# EAGLE design DotSolar (EAGLE 7.7.0)
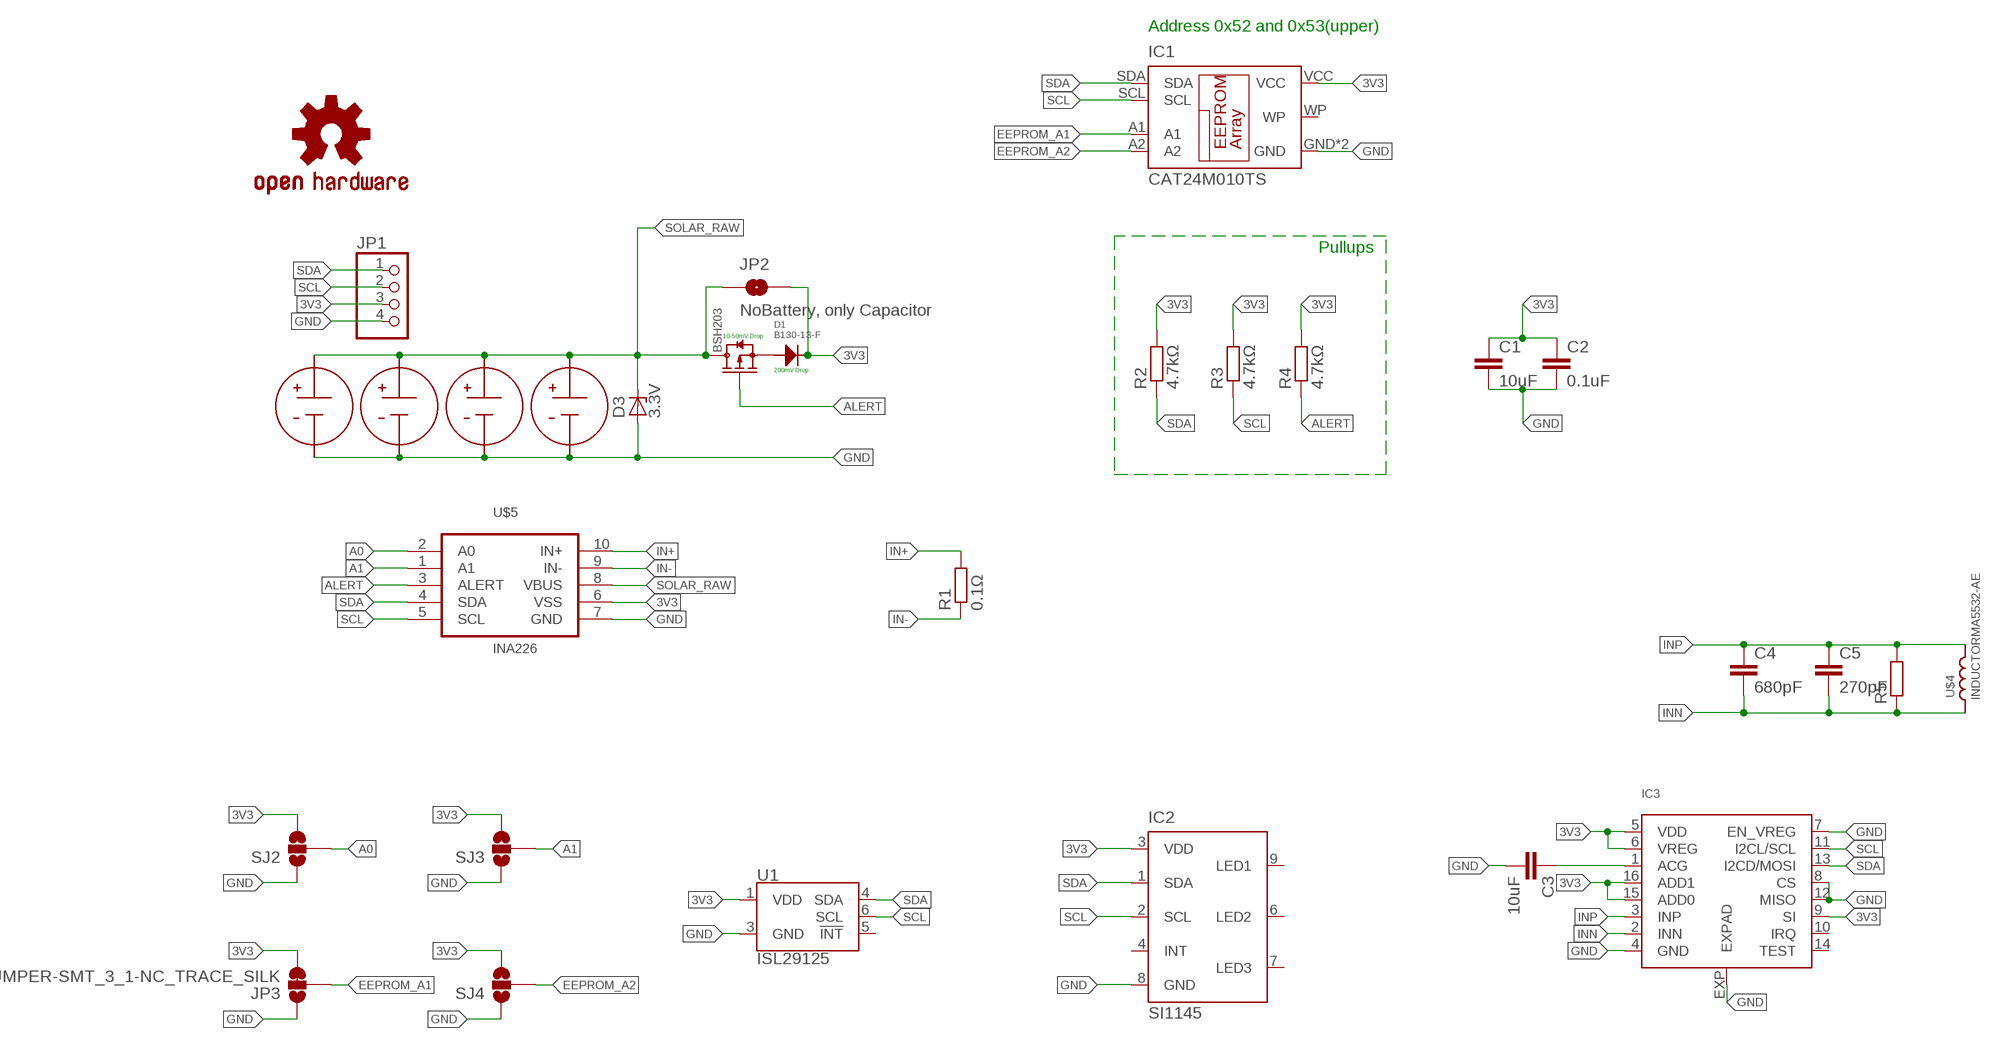
[diagram p0: schematic, sheet 1]

## Parts
C1  10uF  C-EUC0603  [C0603]
C2  0.1uF  C-EUC0603  [C0603]
C3  10uF  C-EUC0603  [C0603]
C4  680pF  C-EUC0603  [C0603]
C5  270pF  C-EUC0603  [C0603]
D1  B130-13-F  DIODE_B130-13-F  [B130-13-F]
D3  3.3V  ZENER-DIODESMB  [SMB]
IC1  CAT24M010TS  [TSSOP8]
IC2  SI1145  [QFN-10]
IC3  AS3935  [16LDMLPQ]
JP1  PINHD-1X4  [1X04]
JP2  NoBattery, only Capacitor  JUMPER-SMT_2_NO_SILK  [SMT-JUMPER_2_NO_SILK]
JP3  JUMPER-SMT_3_1-NC_TRACE_SILK  [SMT-JUMPER_3_1-NC_TRACE_SILK]
LOGO1  OSHW-LOGOS  [OSHW-LOGO-S]
Q1  BSH203  [SOT-23]
R1  0.1Ω  R-EU_R0603  [R0603]
R2  4.7kΩ  R-EU_R0603  [R0603]
R3  4.7kΩ  R-EU_R0603  [R0603]
R4  4.7kΩ  R-EU_R0603  [R0603]
R5  R-EU_R0603  [R0603]
SJ2  SOLDERJUMPER_2WAYPASTE2&3  [SJ_3_PASTE2&3]
SJ3  SOLDERJUMPER_2WAYPASTE2&3  [SJ_3_PASTE2&3]
SJ4  SOLDERJUMPER_2WAYPASTE2&3  [SJ_3_PASTE2&3]
U1  ISL29125  [ODFN-6]
U$1  KXOB22-01X8F_EXTENDED_PADS  [KXOB22-01X8F_EXTENDED_PADS]
U$2  KXOB22-01X8F_EXTENDED_PADS  [KXOB22-01X8F_EXTENDED_PADS]
U$3  KXOB22-01X8F_EXTENDED_PADS  [KXOB22-01X8F_EXTENDED_PADS]
U$4  INDUCTORMA5532-AE  [MA5532-AE]
U$5  INA226  [VSSOP-10]
U$6  KXOB22-01X8F_EXTENDED_PADS  [KXOB22-01X8F_EXTENDED_PADS]

## Nets
3V3: C1.1 C2.1 D1.CATHODE IC1.VCC IC2.3(VDD) IC3.5(VDD) IC3.6(VREG) IC3.9(SI) IC3.15(ADD0) IC3.16(ADD1) JP1.3 JP2.2 JP3.3 R2.2 R3.2 R4.2 SJ2.3 SJ3.3 SJ4.3 U1.1(VDD) U$5.6(VSS)
A0: SJ2.2 U$5.2(A0)
A1: SJ3.2 U$5.1(A1)
ALERT: Q1.1(G) R4.1 U$5.3(ALERT)
EEPROM_A1: IC1.A1 JP3.2
EEPROM_A2: IC1.A2 SJ4.2
GND: C1.2 C2.2 C3.2 D3.A IC1.GND IC1.NC(GND) IC2.8(GND) IC3.4(GND) IC3.7(EN_VREG) IC3.8(CS) IC3.12(MISO) IC3.EXP(EXPAD) JP1.4 JP3.1 SJ2.1 SJ3.1 SJ4.1 U1.3(GND) U$1.P$1 U$2.P$1 U$3.P$1 U$5.7(GND) U$6.P$1
IN+: R1.2 U$5.10(IN+)
IN-: R1.1 U$5.9(IN-)
INN: C4.2 C5.2 IC3.2(INN) R5.1 U$4.2
INP: C4.1 C5.1 IC3.3(INP) R5.2 U$4.1
N$1: D1.ANODE Q1.2(S)
N$3: C3.1 IC3.1(ACG)
SCL: IC1.SCL IC2.2(SCL) IC3.11(I2CL/SCL) JP1.2 R3.1 U1.6(SCL) U$5.5(SCL)
SDA: IC1.SDA IC2.1(SDA) IC3.13(I2CD/MOSI) JP1.1 R2.1 U1.4(SDA) U$5.4(SDA)
SOLAR_RAW: D3.C JP2.1 Q1.3(D) U$1.P$2 U$2.P$2 U$3.P$2 U$5.8(VBUS) U$6.P$2
Unconnected: IC1.WP IC2.4(INT) IC2.6(LED2) IC2.7(LED3) IC2.9(LED1) IC3.10(IRQ) IC3.14(TEST) U1.5(!INT)

## Notes on the sheet
- Address 0x52 and 0x53(upper)
- Pullups
- 10-50mV Drop
- 200mV Drop

## Library data of the parts
C1-C5 = rcl:C-EU: CAPACITOR, European symbol
D1 = PP_Passives:DIODE: Diode - Single
D3 = diode:ZENER-DIODE: Z-Diode
IC1 = CAT24M01YI:CAT24M01: Serial EEPROM 1Mb, I2C; MF: On Semiconductor; MPN: 24C00T-E/ST
IC2 = silabs:SI114*: PROXIMITY/UV/AMBIENT LIGHT SENSOR IC WITH I2C INTERFACE Source: http://www.silabs.com/Support%20Documents/TechnicalDocs/Si1145-46-47.pdf
IC3 = AS3935:AS3935
JP1 = pinhead:PINHD-1X4: PIN HEADER
JP2 = SparkFun-Jumpers:JUMPER-SMT_2_NO: Normally open jumper This jumper has two pads in close proximity to each other. Apply solder to close the connection. Round pads are easier to solder for beginners, but are a lot larger. SparkFun Product that uses the round pads: SparkFun EL Sequencer <https://www.sparkfun.com/products/12781>
JP3 = SparkFun-Jumpers:JUMPER-SMT_3_1-NC_TRACE: Normally closed trace jumper (1 of 2 connections) This jumper has a trace between two pads so it's normally closed (NC). The other connection is normally open (NO). Use a razor knife to open the connection. For best results follow the IPC guidelines for cutting traces: Cutout at least 0.063 mm (0.005 in). Remove all loose material to clean up the cut area. Seal the cut with an approved epoxy. Reapply solder to reclose the connection, or to close the NO connection.
LOGO1 = Particle-Devices:OSHW-LOGO: Open Source Hardware Logo This logo indicates the piece of hardware it is found on incorporates a OSHW license and/or adheres to the definition of open source hardware found here: http://freedomdefined.org/OSHW
Q1 = BSH203:BSH203
R1-R5 = rcl:R-EU_: RESISTOR, European symbol
SJ2-SJ4 = SparkFun:SOLDERJUMPER_2WAY: Solder Jumper 2 way solder jumper
U1 = SparkFun-Sensors:ISL29125: Intersil ISL29125 RGB Color Light Sensor The ISL29125 is a low power, high sensitivity, RED, GREEN and BLUE color light sensor (RGB) with an I2C (SMBus compatible) interface. Its state-of-the-art photodiode array provides an accurate RGB spectral response and excellent light source to light source variation (LS2LS). Datasheet <https://cdn.sparkfun.com/datasheets/Sensors/LightImaging/isl29125.pdf> SparkFun Products SparkFun RGB Light Sensor - ISL29125 <https://www.sparkfun.com/products/12829> (SEN-12829); PROD_ID: IC-12055
U$1-U$3 U$6 = IXYS_Solar_cells:KXOB22-01X8F_EXTENDED_PADS
U$4 = arducorder-mini:INDUCTOR
U$5 = redan:INA226: TI - INA226

## Board
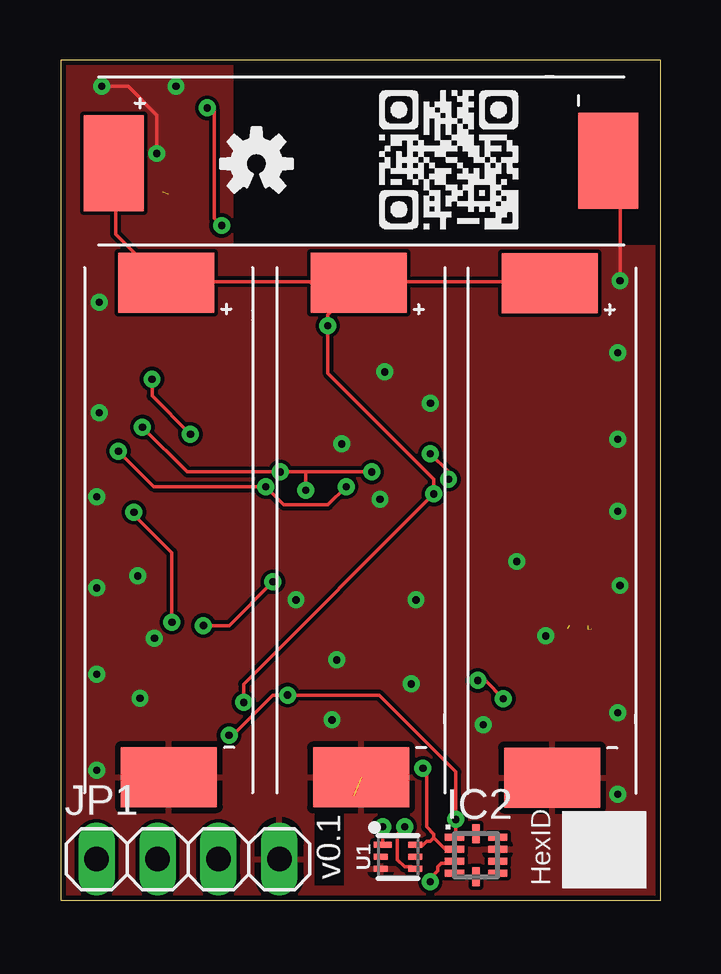
[diagram p1: board, top side]
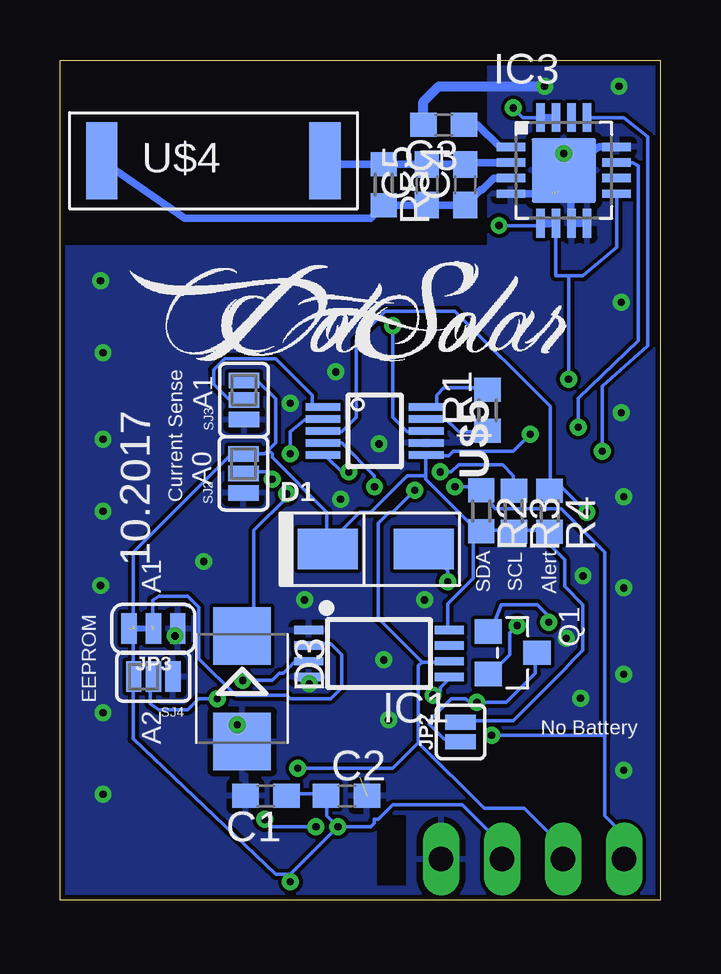
[diagram p2: board, bottom side, seen from below]

Size 25 x 35 mm. Coordinates in mm from the lower left corner, seen from the top.
Outline: 0,0 25,0 25,35 0,35 0,0
Copper layers (1*16): Top 0.035mm / dielectric 1.5mm / Bottom 0.035mm
Design rules "Mihai_default": minimum track width 6mil, minimum drill 0.3mm, track to track 6mil, track to pad 6mil, pad to pad 6mil, via to via 6mil, smd to smd 6mil, copper to edge 8mil, drill to drill 8mil, minimum pad ring 10mil, minimum via ring 8mil, stop-mask expansion 4mil, vias tented up to drill 0mil, thermal gap 10mil
tRestrict: area 10.6,0.6 to 11.8,3.5; area 7.2,27.3 to 24.8,35
bRestrict: area 10.6,0.6 to 11.8,3.5; area 7.2,27.3 to 24.8,35

### Footprints (pad centres in the part's own frame; a part is rotated, then mirrored left to right if it is on the bottom)
C0603 = smd 1.1 x 1: 1 -0.85,0; 2 0.85,0
B130-13-F = smd 2.5 x 1.7: ANODE 2,0; CATHODE -2,0
SMB = smd 2.4 x 2.4: A 2.2,0; C -2.2,0
TSSOP8 = smd 1.2 x 0.35: A1 -2.925,1.595; A2 -2.925,0.945; GND -2.925,0.295; NC -2.925,2.245; SCL 2.925,0.945; SDA 2.925,0.295; VCC 2.925,2.245; WP 2.925,1.595
QFN-10 = smd 0.8 x 0.3: 1 -0.9,0.75; 2 -0.9,0.25; 3 -0.9,-0.25; 4 -0.9,-0.75; 6 0.9,-0.75; 7 0.9,-0.25; 8 0.9,0.25; 9 0.9,0.75 | smd 0.3 x 0.8: 5 0,-0.9; 10 0,0.9
16LDMLPQ = smd 1.2 x 0.35: 1 -2.2,0.975; 2 -2.2,0.325; 3 -2.2,-0.325; 4 -2.2,-0.975; 9 2.2,-0.975; 10 2.2,-0.325; 11 2.2,0.325; 12 2.2,0.975 | smd 0.35 x 1.2: 5 -0.975,-2.2; 6 -0.325,-2.2; 7 0.325,-2.2; 8 0.975,-2.2; 13 0.975,2.2; 14 0.325,2.2; 15 -0.325,2.2; 16 -0.975,2.2 | smd 2.7 x 2.7: EXP 0,0
1X04 = drill 1.016 long: 1 -3.81,0; 2 -1.27,0; 3 1.27,0; 4 3.81,0
SMT-JUMPER_2_NO_SILK = smd 0.635 x 1.27: 1 -0.406,0; 2 0.406,0
SMT-JUMPER_3_1-NC_TRACE_SILK = smd 0.635 x 1.27: 1 -1.016,0; 2 0,0; 3 1.016,0
SOT-23 = smd 1.016 x 1.143: 1 -0.889,-1.016; 2 0.889,-1.016; 3 0,1.016
R0603 = smd 1 x 1.1: 1 -0.85,0; 2 0.85,0
SJ_3_PASTE2&3 = smd 0.635 x 1.27: 1 -0.813,0; 2 0,0; 3 0.813,0
ODFN-6 = smd 0.75 x 0.25: 1 -0.645,0.5 | smd 0.6 x 0.25: 2 -0.72,0; 3 -0.72,-0.5; 4 0.72,-0.5; 5 0.72,0; 6 0.72,0.5
KXOB22-01X8F_EXTENDED_PADS = smd 4 x 2.5: P$1 -0.3,-10; P$2 -0.4,10.6
MA5532-AE = smd 1.3 x 3.2: 1 -4.65,0; 2 4.65,0
VSSOP-10 = smd 0.3 x 1.45: 1 -1,-2.15; 2 -0.5,-2.15; 3 0,-2.15; 4 0.5,-2.15; 5 1,-2.15; 6 1,2.15; 7 0.5,2.15; 8 0,2.15; 9 -0.5,2.15; 10 -1,2.15

### Placement (x,y rotation side)
C1  16.42,4.33 180 bottom
C2  13.06,4.33 0 bottom
C3  9.01,32.3 180 bottom
C4  8.11,29.8 90 bottom
C5  9.71,29.8 90 bottom
D1  11.84,14.62 0 bottom
D3  17.41,8.8 270 bottom
IC1  11.71,9 0 bottom
IC2  17.31,1.86 0 top
IC3  4.01,30.4 0 bottom
JP1  5.31,1.7 0 top
JP2  8.31,7 90 bottom
JP3  21.11,11.3 180 bottom
LOGO1  8.16,30.68 0 top
Q1  6.14,10.3 270 bottom
R1  7.19,20.4 90 bottom
R2  7.45,16.21 270 bottom
R3  6.09,16.19 270 bottom
R4  4.6,16.2 270 bottom
R5  11.51,29.8 270 bottom
SJ2  17.36,17.77 90 bottom
SJ3  17.33,20.83 90 bottom
SJ4  21.11,9.3 180 bottom
U1  14.06,1.79 0 top
U$1  20.78,15.1 0 top
U$2  12.82,15.11 0 top
U$3  12.81,31.1 90 top
U$4  18.61,30.8 0 bottom
U$5  11.89,19.54 270 bottom
U$6  4.81,15.12 0 top

### Tracks (layer width: path | path; a pad name or v marks a point on that pad's centre or on a via)
3V3  (via drill 0.3)  (2 unrouted)
  Top 0.152: v13.42,3.05 U1.1 | v15.4,0.77 15.4,0.92 15.71,1.22 15.71,1.38 15.86,1.53 16.32,1.53 IC2.3 | v3.81,21.7 3.81,21 v5.41,19.4 | v6.11,33 6.31,33 6.41,32.9 6.41,28.4 v6.71,28.1
  Bottom 0.152: 7.48,15.24 7.78,14.94 7.78,13.41 8.85,12.35 8.85,11.28 IC1.VCC | JP2.2 8.24,7.47 6.11,7.47 3.97,9.6 3.61,10 3.21,10.4 3.21,12.3 3.97,13.07 3.97,14.18 4.58,14.79 4.58,15.24 R4.2 4.73,15.4 5.95,15.4 R3.2 6.11,15.4 7.32,15.4 R2.2 7.48,15.24 | 9.76,17.68 9.76,17.53 7.48,15.24 | 9.76,17.68 9.76,18.44 U$5.6 9.7,18.5 8.81,18.5 8.61,18.7 6.11,18.7 v5.41,19.4 | v13.42,3.05 13.88,3.51 13.88,4.27 C2.1 14.03,4.42 15.55,4.42 C1.1 | v13.42,3.05 15.4,1.07 | 21.96,11.28 21.96,9.45 SJ4.3 21.8,9.3 21.8,8.89 21.95,8.84 21.95,6.71 16.01,1.07 15.4,1.07 | 16.32,18.75 16.47,18.6 17.23,18.6 SJ2.3 17.38,18.44 17.99,18.44 21.96,14.48 21.96,11.43 | 16.32,18.75 16.01,19.05 16.01,20.88 16.77,21.64 17.23,21.64 SJ3.3 | 13.88,15.4 13.88,16.16 16.16,18.44 16.16,18.6 16.32,18.75 | 13.88,15.4 13.88,14.63 D1.CATHODE 13.88,15.4 | 15.4,1.07 v15.4,0.77 | v13.42,3.05 12.05,3.05 11.9,3.2 11.9,3.36 11.74,3.36 11.13,3.97 8.24,3.97 6.72,2.44 6.72,1.83 JP1.3 | 9.76,17.68 10.53,17.68 12.05,16.16 12.51,16.16 13.27,15.4 13.88,15.4 | 3.81,26 v3.81,21.7 | IC3.15 5.71,32.6 v6.11,33 | v6.71,28.1 4.58,28.1 IC3.5 | IC3.9 1.81,27.2 3.21,26 3.81,26 | 3.81,26 4.33,26 IC3.6
  Bottom 0.305: IC3.16 IC3.15 | IC3.6 IC3.5
A0  (via drill 0.3)
  Top 0.152: v16.16,17.53 16.16,17.83 v15.4,18.6
  Bottom 0.152: v16.16,17.53 16.16,17.68 16.32,17.83 17.23,17.83 SJ2.2 | v15.4,18.6 15.4,19.51 14.79,20.02 14.34,20.02 14.18,19.97 U$5.2
A1
  Bottom 0.152: SJ3.2 17.38,20.88 17.99,20.88 18.6,21.49 18.6,22.1 18.14,22.56 16.01,22.56 14.49,21.03 14.49,20.58 14.34,20.53 14.18,20.53 U$5.1
ALERT  (via drill 0.3)
  Top 0.152: v3.06,16.16 3.01,16.1 4.64,14.47 v4.64,11.58
  Bottom 0.152: 4.58,17.22 4.58,20.58 8.54,24.54 11.44,24.54 12.66,23.32 12.66,20.12 13.27,19.51 14.03,19.51 U$5.3 | 4.58,17.22 4.58,17.07 R4.1 4.58,17.22 | v4.64,11.58 4.64,11.83 5.11,12.3 6.62,12.3 7.02,11.28 Q1.1 | v3.06,16.16 4.12,17.22 4.58,17.22
EEPROM_A1  (1 unrouted)
  Bottom 0.152: 21.19,11.43 21.14,11.89 21.14,12.5 20.89,12.65 19.67,12.65 19.21,12.2 19.21,10.06 17.69,8.54 15.55,8.54 15.4,8.39 13.72,8.39 13.27,8.84 13.27,10.21 13.72,10.67 14.49,10.67 IC1.A1
EEPROM_A2  (via drill 0.3)
  Top 0.152: v17.38,9.15 17.69,9.15 v18.45,8.39
  Bottom 0.152: v17.38,9.15 16.16,9.15 15.86,9.45 15.71,9.45 15.25,9.91 14.64,9.91 IC1.A2 | v18.45,8.39 19.21,8.39 19.67,7.93 20.89,7.93 21.25,8.19 21.25,8.95 21.19,9.3 SJ4.2
GND  (via drill 0.3)  (2 unrouted)
  Top 0.152: U$3.P$1 23.31,30.3 v23.31,25.8 | v4.01,31.1 4.01,32.7 2.81,33.9 v1.71,33.9
  Bottom 0.152: IC1.GND 14.61,9.3 v14.61,9 | v4.01,31.1 IC3.EXP
  Bottom 0.305: IC3.7 IC3.8 | 3.18,30.08 IC3.EXP | IC3.4 4.48,29.43 IC3.EXP | IC3.12 2.53,31.38 IC3.EXP | 3.71,28.2 3.71,29.5 4.27,29.5 4.27,29.88
  Bottom 0.406: C3.2 9.86,33.25 9.21,33.9 v4.81,33.9
  other vias: 11.31,7.5 11.51,10 1.51,5.4 1.51,9.4 3.31,8.4 3.21,13.5 1.51,13 23.21,22.8 23.21,19.2 23.31,13.1 19.01,14.1 13.31,16.7 3.91,10.9 9.81,12.5 15.41,20.7 13.51,22 11.71,19 20.21,11 23.21,16.2 23.21,7.8 23.21,4.4 1.51,16.8 1.61,20.3 1.61,24.9 14.81,12.5 17.61,7.3
  pour Top: 0.01,0 0.01,35 25.01,35 25.01,0
  pour Bottom: 0.01,0 0.01,35 25.01,35 25.01,0
IN+
  Bottom 0.152: R1.2 7.32,21.34 9,21.34 9.3,21.03 9.3,20.58 9.46,20.53 9.61,20.53 U$5.10
IN-
  Bottom 0.152: R1.1 7.32,19.51 8.39,19.51 9,20.12 9.46,20.12 9.61,19.97 U$5.9
INN
  Bottom 0.305: IC3.2 8.11,30.73 C4.2 C5.2 R5.1 13.96,30.65 U$4.2
INP
  Bottom 0.305: 8.06,29 C4.1 | C4.1 C5.1 R5.2 12.06,28.4 19.81,28.4 U$4.1 | IC3.3 6.93,30.08 7.41,29.6 7.46,29.6 C4.1
N$1  (via drill 0.3)
  Top 0.152: v5.95,11.43 7.02,11.43 v8.85,13.26
  Bottom 0.152: v5.95,11.43 6.26,11.13 6.26,10.21 7.02,9.45 Q1.2 | v8.85,13.26 8.85,13.72 9.76,14.63 D1.ANODE
N$3
  Bottom 0.305: IC3.1 6.68,31.38 7.61,32.3 C3.1
SCL  (via drill 0.3)
  Top 0.152: v12.96,17.83 10.22,17.83 | 10.22,17.83 v9.15,17.83 5.28,17.83 v3.41,19.7 | 15.55,2.59 15.4,2.44 15.25,2.44 15.1,2.29 14.79,2.29 U1.6 | 15.55,2.59 16.01,2.14 16.32,2.14 IC2.2 | 15.55,2.59 15.55,2.75 15.25,3.05 15.25,5.34 v15.1,5.49 | v10.22,17.07 10.22,17.83
  Bottom 0.152: v9.15,17.83 8.7,17.83 8.39,18.14 6.56,18.14 6.11,17.68 6.11,17.07 R3.1 | v12.96,17.83 13.27,17.83 13.88,18.44 13.88,18.6 14.03,18.6 U$5.5 | 9.92,9.91 8.85,9.91 IC1.SCL | 9.92,9.91 10.07,9.76 10.07,6.56 | 10.07,6.56 7.32,3.81 5.65,3.81 4.12,2.29 4.12,1.83 JP1.2 | v15.1,5.49 11.13,5.49 10.07,6.56 | v10.22,17.07 11.13,16.16 11.29,16.16 11.74,15.7 11.74,11.74 9.92,9.91 | IC3.11 1.13,30.73 0.91,30.6 0.91,23.3 3.41,20.9 v3.41,19.7
SDA  (via drill 0.3)
  Top 0.152: v14.34,3.05 14.03,2.75 14.03,1.68 14.34,1.38 14.64,1.38 U1.4 | IC2.1 16.47,2.75 v16.47,3.36 16.47,5.34 13.27,8.54 v9.46,8.54 8.85,8.54 7.17,6.86 v7.02,6.86 | v11.9,17.22 11.13,16.46 9.3,16.46 v8.54,17.22 3.89,17.22 v2.41,18.7
  Bottom 0.152: v14.34,3.05 16.16,3.05 v16.47,3.36 | v9.46,8.54 9.3,8.54 9.15,8.69 9.15,8.84 8.85,9.15 IC1.SDA | 2.29,6.86 2.29,3.51 1.53,2.75 1.53,1.83 JP1.1 | 2.29,6.86 2.29,14.48 4.12,16.31 6.87,16.31 7.02,16.46 7.02,16.62 7.32,16.92 R2.1 7.48,17.07 7.63,17.22 v8.54,17.22 | v11.9,17.22 11.9,17.68 13.27,19.05 U$5.4 | 2.29,6.86 v7.02,6.86 | IC3.13 1.51,32.6 0.51,31.8 0.51,23.1 2.41,21.4 v2.41,18.7
SOLAR_RAW  (via drill 0.3)
  Top 0.152: U$3.P$2 2.29,30.94 2.29,27.74 4.28,25.76 U$6.P$2 4.43,25.76 10.37,25.76 11.44,24.69 | 11.44,24.69 12.35,25.61 U$2.P$2 | 11.44,24.69 11.13,24.39 v11.13,23.93 11.13,21.95 15.55,17.53 v15.55,16.92 7.63,9 v7.63,8.23 | U$1.P$2 20.28,25.76 12.51,25.76 U$2.P$2 | 11.44,24.69 U$2.P$2
  Bottom 0.152: Q1.3 5.19,10.21 5.19,9.45 6.41,8.23 v7.63,8.23 7.93,8.23 8.09,8.39 8.7,8.39 9.61,7.47 9.61,7.32 9,6.71 8.39,6.71 JP2.1 | v11.13,23.93 11.13,20.12 10.53,19.51 9.76,19.51 U$5.8 | v15.55,16.92 15.55,16.77 16.93,15.4 16.93,11.13 D3.C

### Text on the board
tPlace: v0.1 | HexID
bPlace: Current Sense | A1 | A0 | Alert | SDA | SCL | 10.2017 | A1 | EEPROM | No Battery | A2
Document: First solder the light sensors